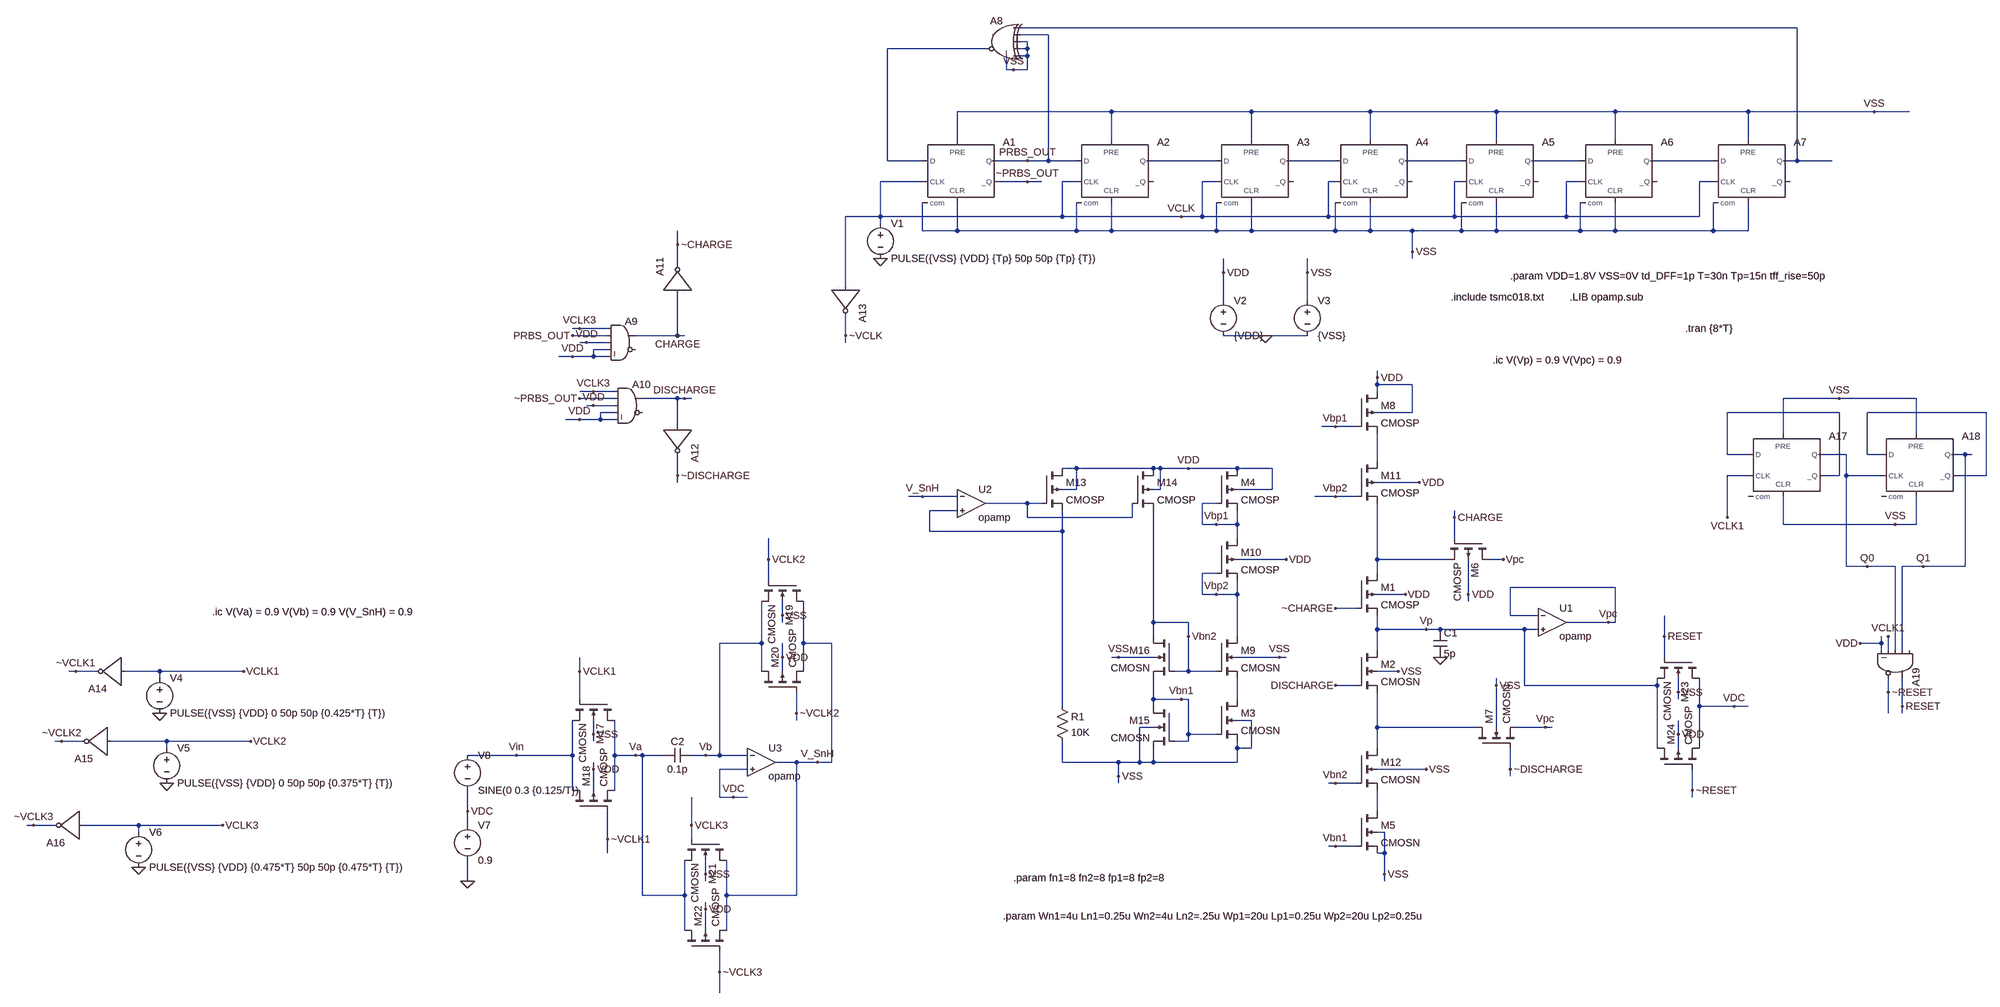
[diagram p0: schematic Current_Mode_Integrator_3.asc]
Current_Mode_Integrator_3.asc, the LTspice schematic file:
Version 4
SHEET 1 1988 1244
WIRE 1552 -1008 -224 -1008
WIRE -160 -992 -224 -992
WIRE -208 -976 -224 -976
WIRE -304 -960 -528 -960
WIRE -208 -960 -208 -976
WIRE -208 -960 -224 -960
WIRE -208 -944 -208 -960
WIRE -208 -944 -224 -944
WIRE -256 -912 -256 -944
WIRE -240 -912 -256 -912
WIRE -208 -912 -208 -944
WIRE -208 -912 -240 -912
WIRE -16 -816 -368 -816
WIRE 304 -816 -16 -816
WIRE 576 -816 304 -816
WIRE 864 -816 576 -816
WIRE 1136 -816 864 -816
WIRE 1440 -816 1136 -816
WIRE 1728 -816 1440 -816
WIRE 1808 -816 1728 -816
WIRE -368 -752 -368 -816
WIRE -16 -752 -16 -816
WIRE 304 -752 304 -816
WIRE 576 -752 576 -816
WIRE 864 -752 864 -816
WIRE 1136 -752 1136 -816
WIRE 1440 -752 1440 -816
WIRE -528 -704 -528 -960
WIRE -448 -704 -528 -704
WIRE -208 -704 -288 -704
WIRE -160 -704 -160 -992
WIRE -160 -704 -208 -704
WIRE -96 -704 -160 -704
WIRE 224 -704 64 -704
WIRE 496 -704 384 -704
WIRE 784 -704 656 -704
WIRE 1056 -704 944 -704
WIRE 1360 -704 1216 -704
WIRE 1552 -704 1552 -1008
WIRE 1552 -704 1520 -704
WIRE 1632 -704 1552 -704
WIRE -448 -656 -544 -656
WIRE -208 -656 -272 -656
WIRE -176 -656 -208 -656
WIRE -96 -656 -128 -656
WIRE 224 -656 192 -656
WIRE 496 -656 480 -656
WIRE 784 -656 768 -656
WIRE 1056 -656 1024 -656
WIRE 1360 -656 1328 -656
WIRE -544 -576 -544 -656
WIRE -544 -576 -624 -576
WIRE -128 -576 -128 -656
WIRE -128 -576 -544 -576
WIRE 144 -576 -128 -576
WIRE 192 -576 192 -656
WIRE 192 -576 144 -576
WIRE 480 -576 480 -656
WIRE 480 -576 192 -576
WIRE 768 -576 768 -656
WIRE 768 -576 480 -576
WIRE 1024 -576 1024 -656
WIRE 1024 -576 768 -576
WIRE 1328 -576 1328 -656
WIRE 1328 -576 1024 -576
WIRE -544 -560 -544 -576
WIRE -448 -544 -448 -608
WIRE -368 -544 -368 -608
WIRE -368 -544 -448 -544
WIRE -96 -544 -96 -608
WIRE -96 -544 -368 -544
WIRE -16 -544 -16 -608
WIRE -16 -544 -96 -544
WIRE 224 -544 224 -608
WIRE 224 -544 -16 -544
WIRE 304 -544 304 -608
WIRE 304 -544 224 -544
WIRE 496 -544 496 -608
WIRE 496 -544 304 -544
WIRE 576 -544 576 -608
WIRE 576 -544 496 -544
WIRE 672 -544 576 -544
WIRE 784 -544 784 -608
WIRE 784 -544 672 -544
WIRE 864 -544 864 -608
WIRE 864 -544 784 -544
WIRE 1056 -544 1056 -608
WIRE 1056 -544 864 -544
WIRE 1136 -544 1136 -608
WIRE 1136 -544 1056 -544
WIRE 1360 -544 1360 -608
WIRE 1360 -544 1136 -544
WIRE 1440 -544 1440 -608
WIRE 1440 -544 1360 -544
WIRE -1008 -512 -1008 -544
WIRE 672 -496 672 -544
WIRE 672 -480 672 -496
WIRE -1008 -464 -1008 -512
WIRE 240 -448 240 -480
WIRE 432 -448 432 -480
WIRE -624 -416 -624 -576
WIRE 240 -384 240 -448
WIRE 432 -384 432 -448
WIRE -1232 -320 -1248 -320
WIRE -1168 -320 -1232 -320
WIRE -1168 -304 -1248 -304
WIRE -1008 -304 -1008 -400
WIRE -1008 -304 -1104 -304
WIRE -992 -304 -1008 -304
WIRE -624 -304 -624 -352
WIRE 336 -304 240 -304
WIRE 432 -304 336 -304
WIRE -1216 -288 -1232 -288
WIRE -1168 -288 -1216 -288
WIRE -624 -288 -624 -304
WIRE -1168 -272 -1200 -272
WIRE -1248 -256 -1280 -256
WIRE -1200 -256 -1200 -272
WIRE -1200 -256 -1248 -256
WIRE -1168 -256 -1200 -256
WIRE 592 -208 592 -224
WIRE 592 -192 592 -208
WIRE 672 -192 592 -192
WIRE -1200 -176 -1232 -176
WIRE -1152 -176 -1200 -176
WIRE 592 -176 592 -192
WIRE -1152 -160 -1232 -160
WIRE -1008 -160 -1088 -160
WIRE -992 -160 -1008 -160
WIRE -976 -160 -992 -160
WIRE 1648 -160 1520 -160
WIRE 1824 -160 1648 -160
WIRE -1200 -144 -1216 -144
WIRE -1152 -144 -1200 -144
WIRE -1152 -128 -1184 -128
WIRE 672 -128 672 -192
WIRE 672 -128 592 -128
WIRE 1648 -128 1392 -128
WIRE 1984 -128 1712 -128
WIRE -1232 -112 -1264 -112
WIRE -1184 -112 -1184 -128
WIRE -1184 -112 -1232 -112
WIRE -1152 -112 -1184 -112
WIRE -1008 -96 -1008 -160
WIRE 496 -96 464 -96
WIRE 544 -96 496 -96
WIRE 1520 -80 1520 -160
WIRE 1824 -80 1824 -160
WIRE 1392 -32 1392 -128
WIRE 1440 -32 1392 -32
WIRE 1664 -32 1600 -32
WIRE 1712 -32 1712 -128
WIRE 1744 -32 1712 -32
WIRE 1936 -32 1904 -32
WIRE 1952 -32 1936 -32
WIRE 592 -16 592 -80
WIRE -96 0 -128 0
WIRE 80 0 -96 0
WIRE 96 0 80 0
WIRE 160 0 96 0
WIRE 272 0 160 0
WIRE 352 0 272 0
WIRE -1008 16 -1008 -32
WIRE 1440 16 1392 16
WIRE 1648 16 1648 -128
WIRE 1648 16 1616 16
WIRE 1664 16 1664 -32
WIRE 1744 16 1664 16
WIRE 1984 16 1984 -128
WIRE 1984 16 1920 16
WIRE -1008 32 -1008 16
WIRE 688 32 592 32
WIRE -96 48 -96 0
WIRE -96 48 -128 48
WIRE 96 48 96 0
WIRE 96 48 80 48
WIRE 352 48 352 0
WIRE 352 48 272 48
WIRE -448 64 -480 64
WIRE -368 64 -448 64
WIRE 496 64 448 64
WIRE 544 64 496 64
WIRE -208 80 -304 80
WIRE -176 80 -208 80
WIRE 224 80 192 80
WIRE -368 96 -432 96
WIRE -208 112 -208 80
WIRE 32 112 32 80
WIRE 32 112 -208 112
WIRE 768 112 768 96
WIRE 1392 112 1392 16
WIRE 192 128 192 80
WIRE 224 128 192 128
WIRE 272 128 272 96
WIRE 272 128 224 128
WIRE 1520 128 1520 64
WIRE 1776 128 1520 128
WIRE 1824 128 1824 64
WIRE 1824 128 1776 128
WIRE -432 144 -432 96
WIRE -128 144 -128 96
WIRE -128 144 -432 144
WIRE 272 160 272 128
WIRE 768 160 768 112
WIRE -800 208 -800 160
WIRE 384 208 272 208
WIRE 592 208 592 80
WIRE 752 208 592 208
WIRE 880 208 848 208
WIRE 1664 224 1664 16
WIRE 1712 224 1664 224
WIRE 1776 224 1712 224
WIRE 1840 224 1792 224
WIRE 1936 224 1936 -32
WIRE 1936 224 1840 224
WIRE 224 240 192 240
WIRE 592 240 592 208
WIRE -800 256 -800 208
WIRE 1136 272 896 272
WIRE 192 288 192 240
WIRE 224 288 192 288
WIRE 272 288 272 256
WIRE 272 288 224 288
WIRE 656 288 592 288
WIRE 800 288 800 208
WIRE 800 304 800 288
WIRE 544 320 496 320
WIRE -768 336 -768 304
WIRE 896 336 896 272
WIRE 960 336 896 336
WIRE -768 352 -768 336
WIRE 80 352 80 96
WIRE 160 352 80 352
WIRE 1120 352 1024 352
WIRE 1136 352 1136 272
WIRE 1136 352 1120 352
WIRE 592 368 592 336
WIRE 704 368 592 368
WIRE 736 368 704 368
WIRE 928 368 736 368
WIRE 960 368 928 368
WIRE 80 384 80 352
WIRE 160 384 160 352
WIRE 272 384 272 288
WIRE 1248 384 1248 336
WIRE -816 400 -816 304
WIRE -816 400 -912 400
WIRE -720 400 -720 304
WIRE -656 400 -720 400
WIRE 1744 400 1744 384
WIRE 1744 400 1696 400
WIRE 592 416 592 368
WIRE 1744 416 1744 400
WIRE 1760 416 1760 384
WIRE 1776 416 1776 224
WIRE 1792 416 1792 224
WIRE -768 432 -768 400
WIRE 0 432 -16 432
WIRE 80 432 0 432
WIRE 368 432 272 432
WIRE 384 432 368 432
WIRE 1248 432 1248 384
WIRE -2384 464 -2400 464
WIRE -2336 464 -2384 464
WIRE -2192 464 -2272 464
WIRE -2000 464 -2192 464
WIRE -1232 464 -1232 432
WIRE -816 464 -816 400
WIRE -768 464 -768 432
WIRE -720 464 -720 400
WIRE 160 464 160 384
WIRE 160 464 128 464
WIRE 224 464 160 464
WIRE 640 464 592 464
WIRE -2192 480 -2192 464
WIRE 544 496 496 496
WIRE 864 496 864 480
WIRE 928 496 928 368
WIRE 1232 496 1232 480
WIRE 1232 496 928 496
WIRE 1280 512 1280 480
WIRE 1760 512 1760 480
WIRE -1232 528 -1232 464
WIRE 80 528 80 480
WIRE 144 528 80 528
WIRE 160 528 144 528
WIRE 272 528 272 480
WIRE 1280 528 1280 512
WIRE -128 544 -128 144
WIRE 80 544 80 528
WIRE 1328 544 1328 480
WIRE 1408 544 1328 544
WIRE 1440 544 1408 544
WIRE 1792 544 1792 480
WIRE -736 560 -736 512
WIRE 1760 560 1760 512
WIRE 1792 560 1792 544
WIRE -736 576 -736 560
WIRE 304 576 272 576
WIRE 80 592 48 592
WIRE 592 592 592 512
WIRE 816 592 592 592
WIRE 864 592 864 496
WIRE 976 592 912 592
WIRE 992 592 976 592
WIRE -1200 608 -1200 576
WIRE 160 608 160 528
WIRE 224 608 160 608
WIRE 1280 608 1280 576
WIRE -2416 624 -2432 624
WIRE -2368 624 -2416 624
WIRE -2176 624 -2304 624
WIRE -1984 624 -2176 624
WIRE -1200 624 -1200 608
WIRE 160 624 160 608
WIRE 160 624 128 624
WIRE -2176 640 -2176 624
WIRE 272 640 272 624
WIRE 304 640 304 576
WIRE 304 640 272 640
WIRE 592 640 592 592
WIRE 1232 640 1232 496
WIRE 1280 640 1280 608
WIRE 1328 640 1328 544
WIRE -1376 656 -1488 656
WIRE -1248 656 -1248 576
WIRE -1248 656 -1376 656
WIRE -1152 656 -1152 576
WIRE -1104 656 -1152 656
WIRE -1088 656 -1104 656
WIRE -1040 656 -1088 656
WIRE -944 656 -976 656
WIRE -912 656 -912 400
WIRE -912 656 -944 656
WIRE -848 656 -912 656
WIRE -736 672 -784 672
WIRE -688 672 -736 672
WIRE -656 672 -656 400
WIRE -656 672 -688 672
WIRE -128 672 -128 624
WIRE 0 672 -128 672
WIRE 48 672 48 592
WIRE 48 672 0 672
WIRE 80 672 80 640
WIRE 80 672 48 672
WIRE 272 672 272 640
WIRE 272 672 80 672
WIRE -1200 688 -1200 672
WIRE -848 688 -912 688
WIRE 704 688 592 688
WIRE 896 688 896 640
WIRE 0 704 0 672
WIRE 896 704 896 688
WIRE 0 720 0 704
WIRE 496 720 480 720
WIRE 544 720 496 720
WIRE -1248 736 -1248 656
WIRE -1200 736 -1200 688
WIRE -1152 736 -1152 656
WIRE 1312 736 1312 688
WIRE -912 752 -912 688
WIRE -880 752 -912 752
WIRE -848 752 -880 752
WIRE 1312 752 1312 736
WIRE -1488 784 -1488 736
WIRE 592 784 592 736
WIRE -2480 816 -2496 816
WIRE -2432 816 -2480 816
WIRE -2240 816 -2368 816
WIRE -2048 816 -2240 816
WIRE -1488 816 -1488 784
WIRE -976 816 -976 752
WIRE -2240 832 -2240 816
WIRE 608 832 592 832
WIRE -1168 848 -1168 784
WIRE -976 848 -976 816
WIRE 496 864 480 864
WIRE 544 864 496 864
WIRE -1168 880 -1168 848
WIRE 608 880 608 832
WIRE 608 880 592 880
WIRE -944 928 -944 896
WIRE 608 928 608 880
WIRE -1488 944 -1488 896
WIRE -944 944 -944 928
WIRE 608 944 608 928
WIRE -1088 976 -1088 656
WIRE -992 976 -992 896
WIRE -992 976 -1088 976
WIRE -896 976 -896 896
WIRE -736 976 -736 672
WIRE -736 976 -896 976
WIRE -944 1008 -944 992
WIRE -992 1056 -992 976
WIRE -944 1056 -944 1008
WIRE -896 1056 -896 976
WIRE -912 1152 -912 1104
WIRE -912 1200 -912 1152
FLAG -544 -480 0
FLAG -240 -912 VSS
FLAG 672 -496 VSS
FLAG -208 -704 PRBS_OUT
FLAG -208 -656 ~PRBS_OUT
FLAG 336 -304 0
FLAG 240 -448 VDD
FLAG 432 -448 VSS
FLAG 736 432 0
FLAG 592 -208 VDD
FLAG 704 368 Vp
FLAG 1120 352 Vpc
FLAG 656 288 VDD
FLAG 640 464 VSS
FLAG 976 592 Vpc
FLAG 768 112 CHARGE
FLAG 896 688 ~DISCHARGE
FLAG 880 208 Vpc
FLAG 1728 -816 VSS
FLAG 144 -576 VCLK
FLAG 160 0 VDD
FLAG 224 128 Vbp1
FLAG 496 -96 Vbp1
FLAG 496 864 Vbn1
FLAG 800 288 VDD
FLAG 864 496 VSS
FLAG 608 928 VSS
FLAG 368 432 VSS
FLAG 384 208 VDD
FLAG 224 288 Vbp2
FLAG 496 64 Vbp2
FLAG 688 32 VDD
FLAG 496 720 Vbn2
FLAG 704 688 VSS
FLAG 0 704 VSS
FLAG 144 528 Vbn1
FLAG 0 432 VSS
FLAG 160 384 Vbn2
FLAG -448 64 V_SnH
FLAG -1248 -304 PRBS_OUT
FLAG -1008 -304 CHARGE
FLAG -1216 -288 VDD
FLAG -1248 -256 VDD
FLAG -1232 -160 ~PRBS_OUT
FLAG -992 -160 DISCHARGE
FLAG -1200 -144 VDD
FLAG -1232 -112 VDD
FLAG -1232 -320 VCLK3
FLAG -1200 -176 VCLK3
FLAG -1008 -512 ~CHARGE
FLAG -1008 16 ~DISCHARGE
FLAG 496 320 ~CHARGE
FLAG 496 496 DISCHARGE
FLAG -624 -304 ~VCLK
FLAG -2192 560 0
FLAG -2384 464 ~VCLK1
FLAG -2000 464 VCLK1
FLAG -2176 720 0
FLAG -1984 624 VCLK2
FLAG -2240 912 0
FLAG -2048 816 VCLK3
FLAG -2416 624 ~VCLK2
FLAG -2480 816 ~VCLK3
FLAG -1488 944 0
FLAG -1488 784 VDC
FLAG -1200 688 VDD
FLAG -944 1008 VDD
FLAG -768 432 VDD
FLAG -768 336 VSS
FLAG -944 928 VSS
FLAG -1200 608 VSS
FLAG -1232 464 VCLK1
FLAG -1168 848 ~VCLK1
FLAG -976 816 VCLK3
FLAG -912 1152 ~VCLK3
FLAG -800 208 VCLK2
FLAG -736 560 ~VCLK2
FLAG -688 672 V_SnH
FLAG -1104 656 Va
FLAG -944 656 Vb
FLAG -1376 656 Vin
FLAG 1280 608 VDD
FLAG 1280 512 VSS
FLAG 1248 384 RESET
FLAG 1312 736 ~RESET
FLAG -880 752 VDC
FLAG 1408 544 VDC
FLAG 1392 112 VCLK1
FLAG 1776 128 VSS
FLAG 1648 -160 VSS
FLAG 1712 224 Q0
FLAG 1840 224 Q1
FLAG 1696 400 VDD
FLAG 1792 544 RESET
FLAG 1760 512 ~RESET
FLAG 1760 384 VCLK1
SYMBOL Digital\\dflop -368 -752 R0
SYMATTR InstName A1
SYMATTR SpiceLine Trise = {tff_rise} Tfall = {tff_rise} Td = td_DFF
SYMATTR Value2 Vhigh = 1.8 Vlow = 0
SYMBOL Digital\\dflop -16 -752 R0
SYMATTR InstName A2
SYMATTR SpiceLine Trise = {tff_rise} Tfall = {tff_rise} Td = td_DFF
SYMATTR Value2 Vhigh = 1.8 Vlow = 0
SYMBOL Digital\\dflop 304 -752 R0
SYMATTR InstName A3
SYMATTR SpiceLine Trise = {tff_rise} Tfall = {tff_rise} Td = td_DFF
SYMATTR Value2 Vhigh = 1.8 Vlow = 0
SYMBOL Digital\\dflop 576 -752 R0
SYMATTR InstName A4
SYMATTR SpiceLine Trise = {tff_rise} Tfall = {tff_rise} Td = td_DFF
SYMATTR Value2 Vhigh = 1.8 Vlow = 0
SYMBOL Digital\\dflop 864 -752 R0
SYMATTR InstName A5
SYMATTR SpiceLine Trise = {tff_rise} Tfall = {tff_rise} Td = td_DFF
SYMATTR Value2 Vhigh = 1.8 Vlow = 0
SYMBOL Digital\\dflop 1136 -752 R0
SYMATTR InstName A6
SYMATTR SpiceLine Trise = {tff_rise} Tfall = {tff_rise} Td = td_DFF
SYMATTR Value2 Vhigh = 1.8 Vlow = 0
SYMBOL Digital\\dflop 1440 -752 R0
SYMATTR InstName A7
SYMATTR SpiceLine Trise = {tff_rise} Tfall = {tff_rise} Td = td_DFF
SYMATTR Value2 Vhigh = 1.8 Vlow = 0
SYMBOL Digital\\xor -272 -1040 M0
SYMATTR InstName A8
SYMATTR Value2 Vhigh = 1.8 Vlow = 0
SYMBOL voltage -544 -576 R0
WINDOW 123 0 0 Left 0
WINDOW 39 0 0 Left 0
SYMATTR InstName V1
SYMATTR Value PULSE({VSS} {VDD} {Tp} 50p 50p {Tp} {T})
SYMBOL voltage 240 -400 R0
WINDOW 123 0 0 Left 0
WINDOW 39 0 0 Left 0
SYMATTR InstName V2
SYMATTR Value {VDD}
SYMBOL voltage 432 -400 R0
WINDOW 123 0 0 Left 0
WINDOW 39 0 0 Left 0
SYMATTR InstName V3
SYMATTR Value {VSS}
SYMBOL pmos4 544 240 R0
SYMATTR InstName M1
SYMATTR Value CMOSP
SYMATTR Value2 l=0.5u w=6u
SYMBOL nmos4 544 416 R0
SYMATTR InstName M2
SYMATTR Value CMOSN
SYMATTR Value2 l=.5u w=6u
SYMBOL cap 720 368 R0
SYMATTR InstName C1
SYMATTR Value 5p
SYMBOL Opamps\\opamp 992 288 R0
SYMATTR InstName U1
SYMATTR SpiceLine2 GBW=300Meg
SYMATTR SpiceLine Aol=500
SYMBOL nmos4 224 528 R0
SYMATTR InstName M3
SYMATTR Value CMOSN
SYMATTR Value2 l={Ln1} w={Wn1} m={fn1}
SYMBOL pmos4 224 0 R0
SYMATTR InstName M4
SYMATTR Value CMOSP
SYMATTR Value2 l={Lp1} w={Wp1} m={fp1}
SYMBOL nmos4 544 784 R0
SYMATTR InstName M5
SYMATTR Value CMOSN
SYMATTR Value2 l={Ln1} w={Wn1} m={fn1}
SYMBOL pmos4 848 160 R90
SYMATTR InstName M6
SYMATTR Value CMOSP
SYMATTR Value2 l=.5u w=6u
SYMBOL nmos4 816 640 R270
SYMATTR InstName M7
SYMATTR Value CMOSN
SYMATTR Value2 l=.5u w=6u
SYMBOL pmos4 544 -176 R0
SYMATTR InstName M8
SYMATTR Value CMOSP
SYMATTR Value2 l={Lp1} w={Wp1} m={fp1}
SYMBOL nmos4 224 384 R0
SYMATTR InstName M9
SYMATTR Value CMOSN
SYMATTR Value2 l={Ln2} w={Wn2} m={fn2}
SYMBOL pmos4 224 160 R0
SYMATTR InstName M10
SYMATTR Value CMOSP
SYMATTR Value2 l={Lp2} w={Wp2} m={fp2}
SYMBOL pmos4 544 -16 R0
SYMATTR InstName M11
SYMATTR Value CMOSP
SYMATTR Value2 l={Lp2} w={Wp2} m={fp2}
SYMBOL nmos4 544 640 R0
SYMATTR InstName M12
SYMATTR Value CMOSN
SYMATTR Value2 l={Ln2} w={Wn2} m={fn2}
SYMBOL pmos4 -176 0 R0
SYMATTR InstName M13
SYMATTR Value CMOSP
SYMATTR Value2 l=1u w=6u
SYMBOL res -144 528 R0
SYMATTR InstName R1
SYMATTR Value 10K
SYMBOL pmos4 32 0 R0
SYMATTR InstName M14
SYMATTR Value CMOSP
SYMATTR Value2 l=1u w=6u
SYMBOL nmos4 128 544 M0
SYMATTR InstName M15
SYMATTR Value CMOSN
SYMATTR Value2 l={Ln1} w={Wn1} m={fn1}
SYMBOL Opamps\\opamp -336 16 R0
SYMATTR InstName U2
SYMATTR SpiceLine2 GBW=200Meg
SYMATTR SpiceLine Aol=500
SYMBOL nmos4 128 384 M0
SYMATTR InstName M16
SYMATTR Value CMOSN
SYMATTR Value2 l={Ln2} w={Wn2} m={fn2}
SYMBOL Digital\\and -1136 -352 R0
SYMATTR InstName A9
SYMATTR Value2 Vhigh = 1.8 Vlow = 0
SYMATTR SpiceLine Trise = {tff_rise} Tfall = {tff_rise} Td = td_DFF
SYMBOL Digital\\and -1120 -208 R0
SYMATTR InstName A10
SYMATTR Value2 Vhigh = 1.8 Vlow = 0
SYMATTR SpiceLine Trise = {tff_rise} Tfall = {tff_rise} Td = td_DFF
SYMBOL Digital\\inv -1072 -400 R270
SYMATTR InstName A11
SYMATTR SpiceLine Trise = {tff_rise} Tfall = {tff_rise} Td = td_DFF
SYMATTR Value2 Vhigh = 1.8 Vlow = 0
SYMBOL Digital\\inv -944 -96 R90
SYMATTR InstName A12
SYMATTR Value2 Vhigh = 1.8 Vlow = 0
SYMATTR SpiceLine Trise = {tff_rise} Tfall = {tff_rise} Td = td_DFF
SYMBOL Digital\\inv -560 -416 R90
SYMATTR InstName A13
SYMATTR Value2 Vhigh = 1.8 Vlow = 0
SYMATTR SpiceLine Trise = {tff_rise} Tfall = {tff_rise} Td = td_DFF
SYMBOL voltage -2192 464 R0
WINDOW 123 0 0 Left 0
WINDOW 39 0 0 Left 0
SYMATTR InstName V4
SYMATTR Value PULSE({VSS} {VDD} 0 50p 50p {0.425*T} {T})
SYMBOL Digital\\inv -2272 528 R180
SYMATTR InstName A14
SYMATTR Value2 Vhigh = 1.8 Vlow = 0
SYMATTR SpiceLine Trise = {tff_rise} Tfall = {tff_rise} Td = td_DFF
SYMBOL voltage -2176 624 R0
WINDOW 123 0 0 Left 0
WINDOW 39 0 0 Left 0
SYMATTR InstName V5
SYMATTR Value PULSE({VSS} {VDD} 0 50p 50p {0.375*T} {T})
SYMBOL voltage -2240 816 R0
WINDOW 123 0 0 Left 0
WINDOW 39 0 0 Left 0
SYMATTR InstName V6
SYMATTR Value PULSE({VSS} {VDD} {0.475*T} 50p 50p {0.475*T} {T})
SYMBOL voltage -1488 800 R0
WINDOW 123 0 0 Left 0
WINDOW 39 0 0 Left 0
SYMATTR InstName V7
SYMATTR Value 0.9
SYMBOL nmos4 -1152 528 R90
SYMATTR InstName M17
SYMATTR Value CMOSN
SYMATTR Value2 l=1u w=4u
SYMBOL pmos4 -1248 784 R270
SYMATTR InstName M18
SYMATTR Value CMOSP
SYMATTR Value2 l=1u w=4u
SYMBOL Digital\\inv -2304 688 R180
SYMATTR InstName A15
SYMATTR Value2 Vhigh = 1.8 Vlow = 0
SYMATTR SpiceLine Trise = {tff_rise} Tfall = {tff_rise} Td = td_DFF
SYMBOL Digital\\inv -2368 880 R180
SYMATTR InstName A16
SYMATTR Value2 Vhigh = 1.8 Vlow = 0
SYMATTR SpiceLine Trise = {tff_rise} Tfall = {tff_rise} Td = td_DFF
SYMBOL cap -976 640 R90
WINDOW 0 0 32 VBottom 2
WINDOW 3 32 32 VTop 2
SYMATTR InstName C2
SYMATTR Value 0.1p
SYMBOL Opamps\\opamp -816 608 R0
SYMATTR InstName U3
SYMATTR SpiceLine2 GBW=300mega
SYMATTR SpiceLine Aol=500
SYMBOL nmos4 -720 256 R90
SYMATTR InstName M19
SYMATTR Value CMOSN
SYMATTR Value2 l=1u w=4u
SYMBOL pmos4 -816 512 R270
SYMATTR InstName M20
SYMATTR Value CMOSP
SYMATTR Value2 l=1u w=4u
SYMBOL nmos4 -896 848 R90
SYMATTR InstName M21
SYMATTR Value CMOSN
SYMATTR Value2 l=1u w=4u
SYMBOL pmos4 -992 1104 R270
SYMATTR InstName M22
SYMATTR Value CMOSP
SYMATTR Value2 l=1u w=4u
SYMBOL voltage -1488 640 R0
WINDOW 123 0 0 Left 0
WINDOW 39 0 0 Left 0
SYMATTR InstName V8
SYMATTR Value SINE(0 0.3 {0.125/T})
SYMBOL nmos4 1328 432 R90
SYMATTR InstName M23
SYMATTR Value CMOSN
SYMATTR Value2 l=1u w=4u m=3
SYMBOL pmos4 1232 688 R270
SYMATTR InstName M24
SYMATTR Value CMOSP
SYMATTR Value2 l=1u w=4u m=3
SYMBOL Digital\\dflop 1520 -80 R0
SYMATTR InstName A17
SYMATTR SpiceLine Trise = {tff_rise} Tfall = {tff_rise} Td = td_DFF
SYMATTR Value2 Vhigh = 1.8 Vlow = 0
SYMBOL Digital\\dflop 1824 -80 R0
SYMATTR InstName A18
SYMATTR SpiceLine Trise = {tff_rise} Tfall = {tff_rise} Td = td_DFF
SYMATTR Value2 Vhigh = 1.8 Vlow = 0
SYMBOL Digital\\and 1840 448 R90
SYMATTR InstName A19
SYMATTR SpiceLine Trise = {tff_rise} Tfall = {tff_rise} Td = td_DFF
SYMATTR Value2 Vhigh = 1.8 Vlow = 0
TEXT 896 -440 Left 2 !.param VDD=1.8V VSS=0V td_DFF=1p T=30n Tp=15n tff_rise=50p
TEXT 856 -248 Left 2 !.ic V(Vp) = 0.9 V(Vpc) = 0.9
TEXT 760 -392 Left 2 !.include tsmc018.txt
TEXT 1296 -320 Left 2 !.tran {8*T}
TEXT 1032 -392 Left 2 !.LIB opamp.sub
TEXT -264 1024 Left 2 !.param Wn1=4u Ln1=0.25u Wn2=4u Ln2=.25u Wp1=20u Lp1=0.25u Wp2=20u Lp2=0.25u
TEXT -240 936 Left 2 !.param fn1=8 fn2=8 fp1=8 fp2=8
TEXT -2072 328 Left 2 !.ic V(Va) = 0.9 V(Vb) = 0.9 V(V_SnH) = 0.9

The netlist it stands for:
* Current_Mode_Integrator_3.asc
A1 N002 VSS VCLK VSS VSS ~PRBS_OUT PRBS_OUT VSS DFLOP Vhigh = 1.8 Vlow = 0 Trise = {tff_rise} Tfall = {tff_rise} Td = td_DFF
A2 PRBS_OUT VSS VCLK VSS VSS VSS N003 VSS DFLOP Vhigh = 1.8 Vlow = 0 Trise = {tff_rise} Tfall = {tff_rise} Td = td_DFF
A3 N003 VSS VCLK VSS VSS VSS N004 VSS DFLOP Vhigh = 1.8 Vlow = 0 Trise = {tff_rise} Tfall = {tff_rise} Td = td_DFF
A4 N004 VSS VCLK VSS VSS VSS N005 VSS DFLOP Vhigh = 1.8 Vlow = 0 Trise = {tff_rise} Tfall = {tff_rise} Td = td_DFF
A5 N005 VSS VCLK VSS VSS VSS N006 VSS DFLOP Vhigh = 1.8 Vlow = 0 Trise = {tff_rise} Tfall = {tff_rise} Td = td_DFF
A6 N006 VSS VCLK VSS VSS VSS N007 VSS DFLOP Vhigh = 1.8 Vlow = 0 Trise = {tff_rise} Tfall = {tff_rise} Td = td_DFF
A7 N007 VSS VCLK VSS VSS VSS N001 VSS DFLOP Vhigh = 1.8 Vlow = 0 Trise = {tff_rise} Tfall = {tff_rise} Td = td_DFF
A8 N001 PRBS_OUT VSS VSS VSS N002 VSS VSS XOR Vhigh = 1.8 Vlow = 0
V1 VCLK 0 PULSE({VSS} {VDD} {Tp} 50p 50p {Tp} {T})
V2 VDD 0 {VDD}
V3 VSS 0 {VSS}
M1 N013 ~CHARGE Vp VDD CMOSP l=0.5u w=6u
M2 Vp DISCHARGE N015 VSS CMOSN l=.5u w=6u
C1 Vp 0 5p
XU1 Vpc Vp Vpc opamp Aol=500 GBW=300Meg  ; pins invin noninvin out
M3 N014 Vbn1 VSS VSS CMOSN l={Ln1} w={Wn1} m={fn1}
M4 VDD Vbp1 Vbp1 VDD CMOSP l={Lp1} w={Wp1} m={fp1}
M5 N016 Vbn1 VSS VSS CMOSN l={Ln1} w={Wn1} m={fn1}
M6 Vpc CHARGE N013 VDD CMOSP l=.5u w=6u
M7 N015 ~DISCHARGE Vpc VSS CMOSN l=.5u w=6u
M8 VDD Vbp1 N010 VDD CMOSP l={Lp1} w={Wp1} m={fp1}
M9 Vbp2 Vbn2 N014 VSS CMOSN l={Ln2} w={Wn2} m={fn2}
M10 Vbp1 Vbp2 Vbp2 VDD CMOSP l={Lp2} w={Wp2} m={fp2}
M11 N010 Vbp2 N013 VDD CMOSP l={Lp2} w={Wp2} m={fp2}
M12 N015 Vbn2 N016 VSS CMOSN l={Ln2} w={Wn2} m={fn2}
M13 VDD N011 N012 VDD CMOSP l=1u w=6u
R1 N012 VSS 10K
M14 VDD N011 Vbn2 VDD CMOSP l=1u w=6u
M15 Vbn1 Vbn1 VSS VSS CMOSN l={Ln1} w={Wn1} m={fn1}
XU2 V_SnH N012 N011 opamp Aol=500 GBW=200Meg  ; pins invin noninvin out
M16 Vbn2 Vbn2 Vbn1 VSS CMOSN l={Ln2} w={Wn2} m={fn2}
A9 VCLK3 PRBS_OUT VDD VDD VDD 0 CHARGE 0 AND Vhigh = 1.8 Vlow = 0 Trise = {tff_rise} Tfall = {tff_rise} Td = td_DFF
A10 VCLK3 ~PRBS_OUT VDD VDD VDD 0 DISCHARGE 0 AND Vhigh = 1.8 Vlow = 0 Trise = {tff_rise} Tfall = {tff_rise} Td = td_DFF
A11 CHARGE 0 0 0 0 ~CHARGE 0 0 BUF Vhigh = 1.8 Vlow = 0 Trise = {tff_rise} Tfall = {tff_rise} Td = td_DFF
A12 DISCHARGE 0 0 0 0 ~DISCHARGE 0 0 BUF Vhigh = 1.8 Vlow = 0 Trise = {tff_rise} Tfall = {tff_rise} Td = td_DFF
A13 VCLK 0 0 0 0 ~VCLK 0 0 BUF Vhigh = 1.8 Vlow = 0 Trise = {tff_rise} Tfall = {tff_rise} Td = td_DFF
V4 VCLK1 0 PULSE({VSS} {VDD} 0 50p 50p {0.425*T} {T})
A14 VCLK1 0 0 0 0 ~VCLK1 0 0 BUF Vhigh = 1.8 Vlow = 0 Trise = {tff_rise} Tfall = {tff_rise} Td = td_DFF
V5 VCLK2 0 PULSE({VSS} {VDD} 0 50p 50p {0.375*T} {T})
V6 VCLK3 0 PULSE({VSS} {VDD} {0.475*T} 50p 50p {0.475*T} {T})
V7 VDC 0 0.9
M17 Va VCLK1 Vin VSS CMOSN l=1u w=4u
M18 Vin ~VCLK1 Va VDD CMOSP l=1u w=4u
A15 VCLK2 0 0 0 0 ~VCLK2 0 0 BUF Vhigh = 1.8 Vlow = 0 Trise = {tff_rise} Tfall = {tff_rise} Td = td_DFF
A16 VCLK3 0 0 0 0 ~VCLK3 0 0 BUF Vhigh = 1.8 Vlow = 0 Trise = {tff_rise} Tfall = {tff_rise} Td = td_DFF
C2 Vb Va 0.1p
XU3 Vb VDC V_SnH opamp Aol=500 GBW=300mega  ; pins invin noninvin out
M19 V_SnH VCLK2 Vb VSS CMOSN l=1u w=4u
M20 Vb ~VCLK2 V_SnH VDD CMOSP l=1u w=4u
M21 V_SnH VCLK3 Va VSS CMOSN l=1u w=4u
M22 Va ~VCLK3 V_SnH VDD CMOSP l=1u w=4u
V8 Vin VDC SINE(0 0.3 {0.125/T})
M23 VDC RESET Vp VSS CMOSN l=1u w=4u m=3
M24 Vp ~RESET VDC VDD CMOSP l=1u w=4u m=3
A17 N008 0 VCLK1 VSS VSS N008 Q0 0 DFLOP Vhigh = 1.8 Vlow = 0 Trise = {tff_rise} Tfall = {tff_rise} Td = td_DFF
A18 N009 0 Q0 VSS VSS N009 Q1 0 DFLOP Vhigh = 1.8 Vlow = 0 Trise = {tff_rise} Tfall = {tff_rise} Td = td_DFF
A19 0 Q1 Q0 VCLK1 VDD ~RESET RESET 0 AND Vhigh = 1.8 Vlow = 0 Trise = {tff_rise} Tfall = {tff_rise} Td = td_DFF
.model NMOS NMOS
.model PMOS PMOS
.lib standard.mos
.param VDD=1.8V VSS=0V td_DFF=1p T=30n Tp=15n tff_rise=50p
.ic V(Vp) = 0.9 V(Vpc) = 0.9
.include tsmc018.txt
.tran {8*T}
.LIB opamp.sub
.param Wn1=4u Ln1=0.25u Wn2=4u Ln2=.25u Wp1=20u Lp1=0.25u Wp2=20u Lp2=0.25u
.param fn1=8 fn2=8 fp1=8 fp2=8
.ic V(Va) = 0.9 V(Vb) = 0.9 V(V_SnH) = 0.9
.backanno
.end